# EAGLE schematic SmartMeter (EAGLE 7.6.0)
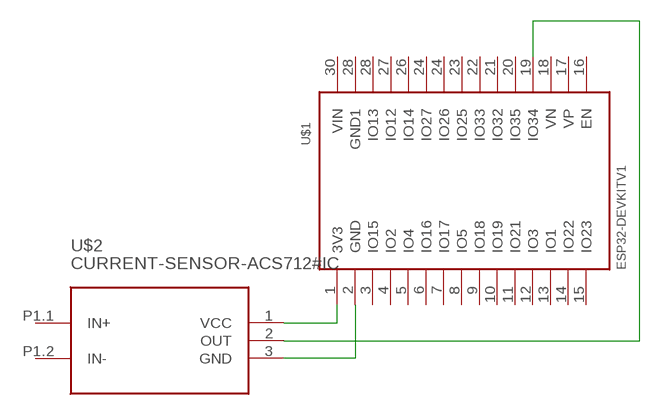
[diagram p0: schematic, sheet 1]

## Parts
U$1  ESP32DEVKITV1  [ESP32-DEVKITV1]
U$2  CURRENT-SENSOR-ACS712#IC  [CURRENT-SENSOR-ACS712#IC]

## Nets
N$1: U$1.1(3V3) U$2.1(VCC)
N$2: U$1.2(GND) U$2.3(GND)
N$3: U$1.19(IO34) U$2.2(OUT)
Unconnected: U$1.3(IO15) U$1.4(IO2) U$1.5(IO4) U$1.6(IO16) U$1.7(IO17) U$1.8(IO5) U$1.9(IO18) U$1.10(IO19) U$1.11(IO21) U$1.12(IO3) U$1.13(IO1) U$1.14(IO22) U$1.15(IO23) U$1.16(EN) U$1.17(VP) U$1.18(VN) U$1.20(IO35) U$1.21(IO32) U$1.22(IO33) U$1.23(IO25) U$1.24(IO26) U$1.24(IO27) U$1.26(IO14) U$1.27(IO12) U$1.28(GND1) U$1.28(IO13) U$1.30(VIN) U$2.P1.1(IN+) U$2.P1.2(IN-)

## Library data of the parts
U$1 = ESP32-DEVKITV1:ESP32DEVKITV1
U$2 = diy-modules:CURRENT-SENSOR-ACS712#IC: Isolated Bipolar Current Sensors based on ACS712 chip Symbol with input pins More details available here: http://embedded-lab.com/blog/a-brief-overview-of-allegro-acs712-current-sensor-part-1/ Click here to find device on ebay.com <http://www.ebay.com/sch/acs712+module> Note: There are many available versions with different pinout. Please check before use